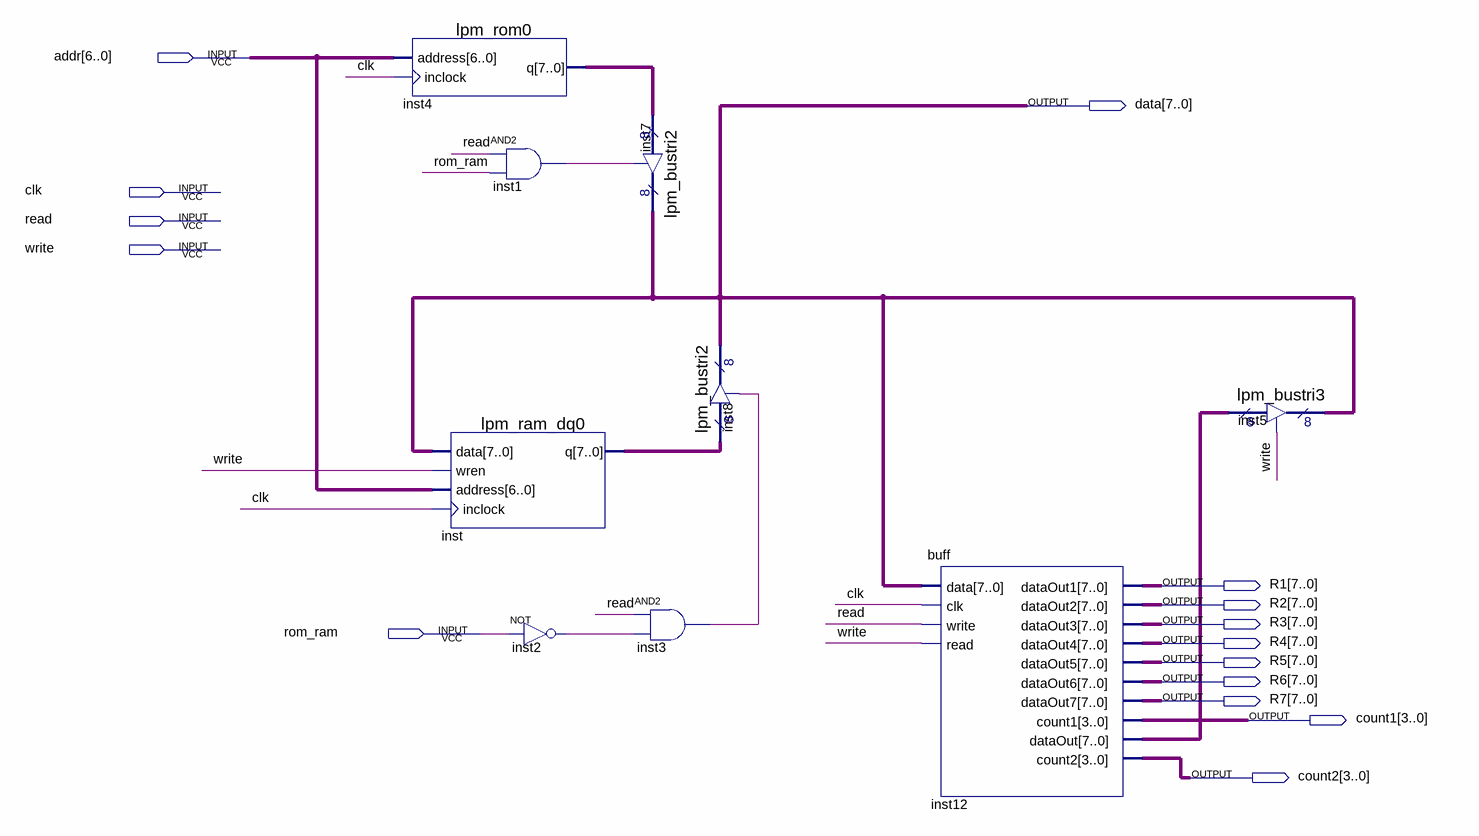
[diagram p0: schematic sheet]
// Quartus schematic lab3_1_1.bdf as structural Verilog: 9 symbols, 15 pins
module lab3_1_1 (
  input  [6:0] addr,
  input  clk,
  input  read,
  input  write,
  input  rom_ram,
  output [7:0] data,
  output [7:0] R1,
  output [7:0] R2,
  output [7:0] R3,
  output [7:0] R4,
  output [7:0] R5,
  output [7:0] R6,
  output [7:0] R7,
  output [3:0] count1,
  output [3:0] count2
);

  wire inst1_out, inst2_out, inst3_out;
  wire [7:0] inst4_q, inst12_dataout, inst_q;

  lpm_rom0 inst4 (.address(addr), .inclock(clk), .q(inst4_q));
  lpm_ram_dq0 inst (.data(data), .wren(write), .address(addr), .inclock(clk), .q(inst_q));
  and inst1 (inst1_out, read, rom_ram);
  not inst2 (inst2_out, rom_ram);
  lpm_bustri2 inst7 (.enabledt(inst1_out), .data(inst4_q), .tridata(data));
  and inst3 (inst3_out, read, inst2_out);
  lpm_bustri2 inst8 (.enabledt(inst3_out), .data(inst_q), .tridata(data));
  buff inst12 (
    .data(data), .clk(clk), .write(read), .read(write), .dataOut1(R1), .dataOut2(R2), .dataOut3(R3),
    .dataOut4(R4), .dataOut5(R5), .dataOut6(R6), .dataOut7(R7), .count1(count1), .dataOut(inst12_dataout),
    .count2(count2));
  lpm_bustri3 inst5 (.enabledt(write), .data(inst12_dataout), .tridata(data));
endmodule
